# EAGLE design 7006268-1 (EAGLE 6.6.0)
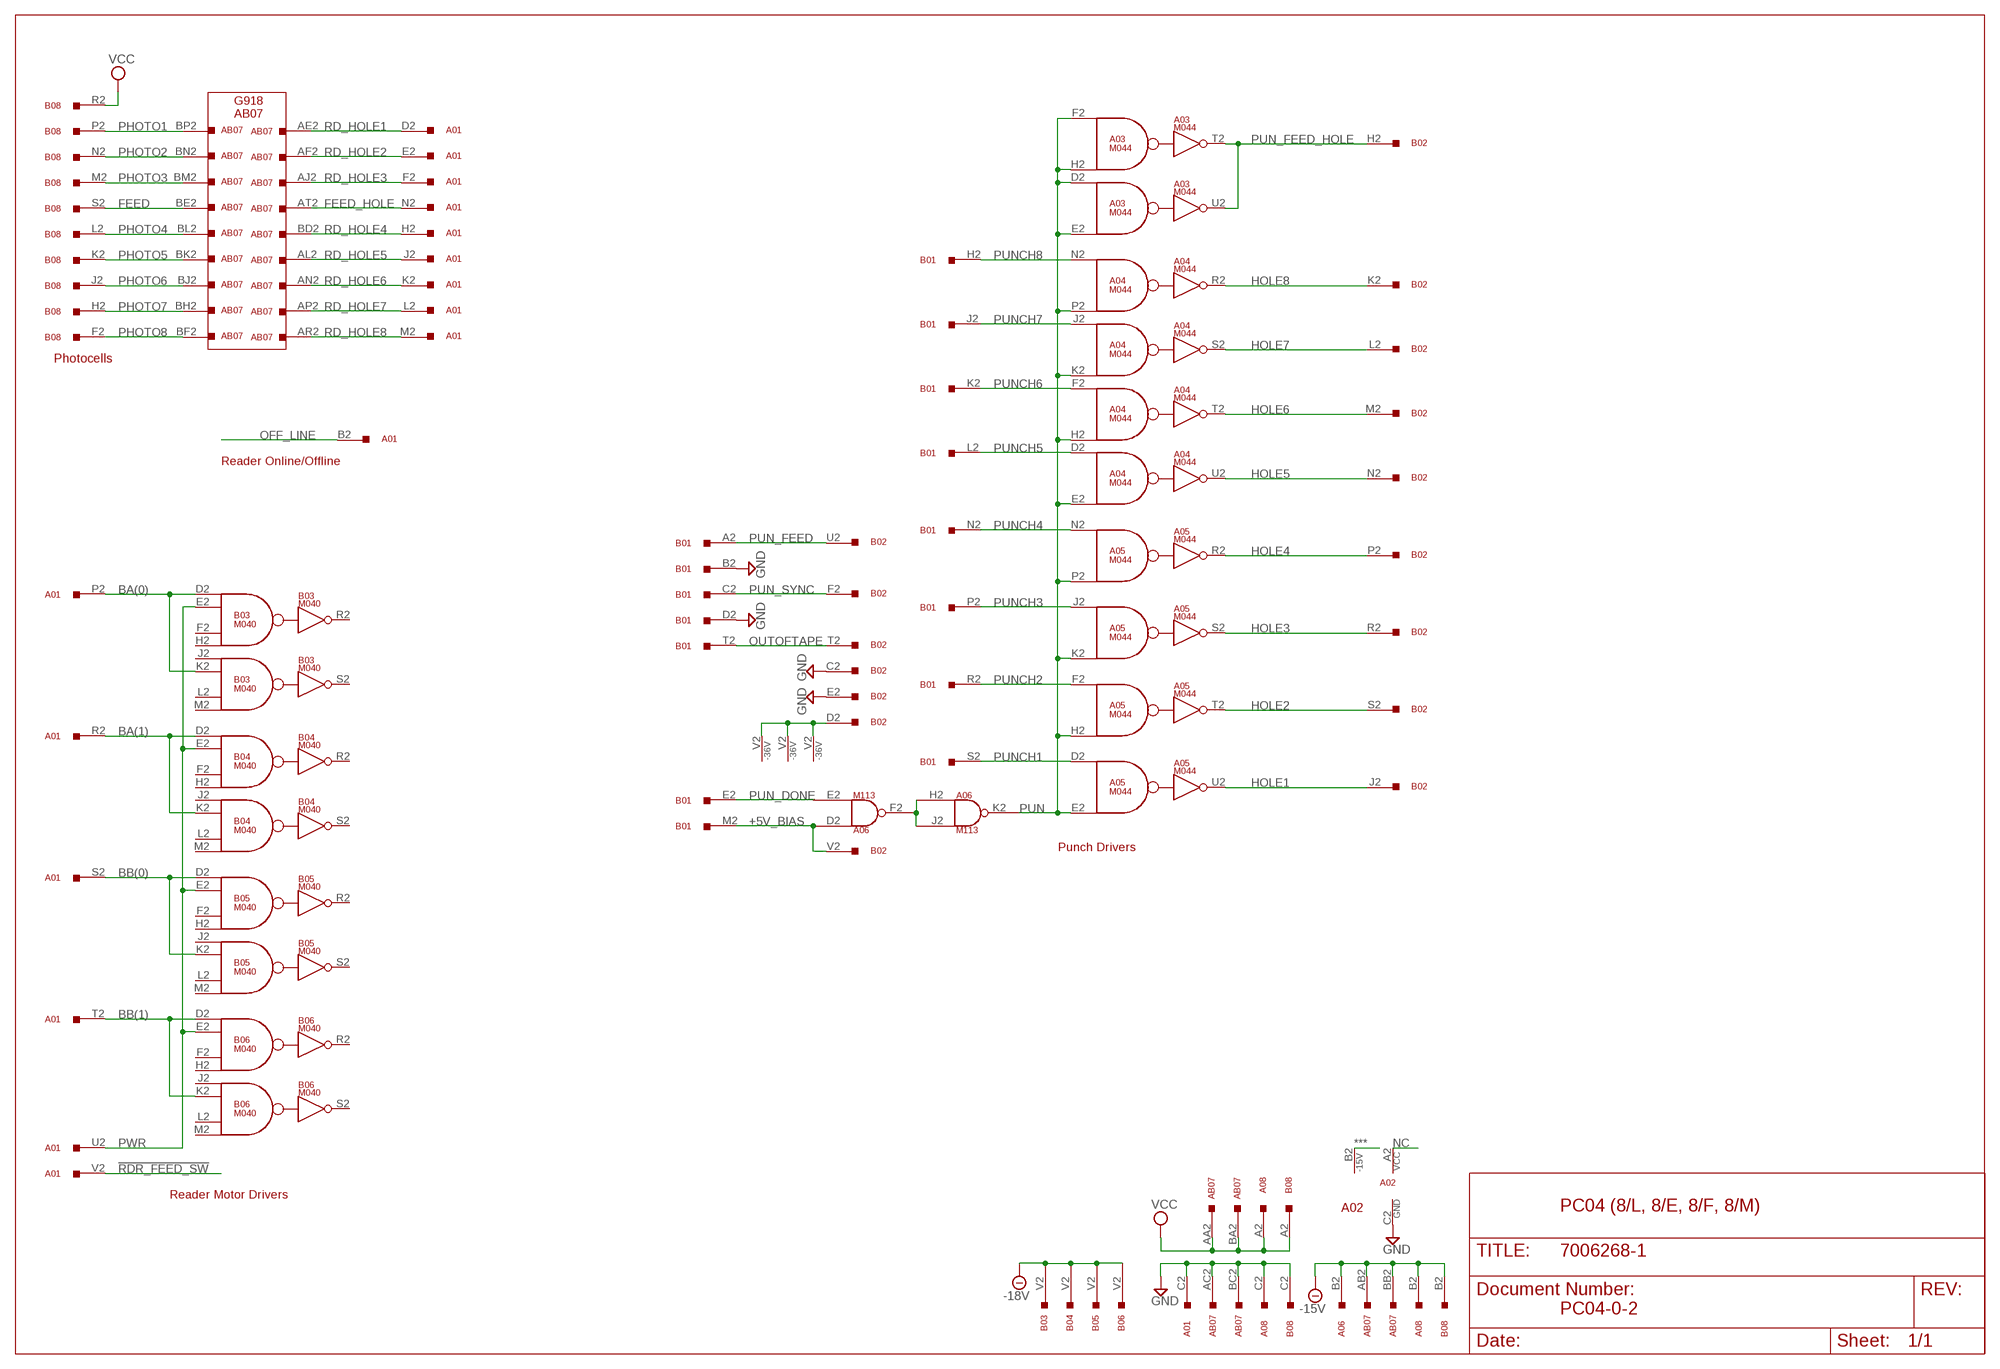
[diagram p0: schematic, sheet 1]

## Parts
A01  W033  W023  [H807]
A02  EMPTY  [H807]
A03  M044  [H807]
A04  M044  [H807]
A05  M044  [H807]
A06  M113  [H807]
A08  W033  W023  [H807]
AB07  G918  W991  [H807-2]
B01  W033  W023  [H807]
B02  W033  W023  [H807]
B03  M040  [H807]
B04  M040  [H807]
B05  M040  [H807]
B06  M040  [H807]
B08  W033  W023  [H807]

## Nets
!RDR_FEED_SW: A01.V2
***: A02.B2
+5V_BIAS: A06.D2(F2:IN1) B01.M2 B02.V2
-15V: A06.B2 A08.B2 AB07.AB2 AB07.BB2 B08.B2
-18V: B03.V2 B04.V2 B05.V2 B06.V2
-36V: A03.V2(-36V) A04.V2(-36V) A05.V2(-36V) B02.D2
BA(0): A01.P2 B03.D2(D) B03.K2(E)
BA(1): A01.R2 B04.D2(D) B04.K2(E)
BB(0): A01.S2 B05.D2(D) B05.K2(E)
BB(1): A01.T2 B06.D2(D) B06.K2(E)
FEED: AB07.BE2 B08.S2
FEED_HOLE: A01.N2 AB07.AT2
GND: A01.C2 A02.C2 A08.C2 AB07.AC2 AB07.BC2 B01.B2 B01.D2 B02.C2 B02.E2 B08.C2
HOLE1: A05.U2(R) B02.J2
HOLE2: A05.T2(R) B02.S2
HOLE3: A05.S2(R) B02.R2
HOLE4: A05.R2(R) B02.P2
HOLE5: A04.U2(R) B02.N2
HOLE6: A04.T2(R) B02.M2
HOLE7: A04.S2(R) B02.L2
HOLE8: A04.R2(R) B02.K2
N$4: A06.F2(F2:OUT) A06.H2(K2:IN1) A06.J2(K2:IN2)
NC: A02.A2
OFF_LINE: A01.B2
OUTOFTAPE: B01.T2 B02.T2
PHOTO1: AB07.BP2 B08.P2
PHOTO2: AB07.BN2 B08.N2
PHOTO3: AB07.BM2 B08.M2
PHOTO4: AB07.BL2 B08.L2
PHOTO5: AB07.BK2 B08.K2
PHOTO6: AB07.BJ2 B08.J2
PHOTO7: AB07.BH2 B08.H2
PHOTO8: AB07.BF2 B08.F2
PUN: A03.D2(D) A03.E2(H) A03.F2(D) A03.H2(H) A04.E2(H) A04.H2(H) A04.K2(H) A04.P2(H) A05.E2(H) A05.H2(H) A05.K2(H) A05.P2(H) A06.K2(K2:OUT)
PUN_DONE: A06.E2(F2:IN2) B01.E2
PUN_FEED: B01.A2 B02.U2
PUN_FEED_HOLE: A03.T2(R) A03.U2(R) B02.H2
PUN_SYNC: B01.C2 B02.F2
PUNCH1: A05.D2(D) B01.S2
PUNCH2: A05.F2(D) B01.R2
PUNCH3: A05.J2(D) B01.P2
PUNCH4: A05.N2(D) B01.N2
PUNCH5: A04.D2(D) B01.L2
PUNCH6: A04.F2(D) B01.K2
PUNCH7: A04.J2(D) B01.J2
PUNCH8: A04.N2(D) B01.H2
PWR: A01.U2 B03.E2(E) B04.E2(E) B05.E2(E) B06.E2(E)
RD_HOLE1: A01.D2 AB07.AE2
RD_HOLE2: A01.E2 AB07.AF2
RD_HOLE3: A01.F2 AB07.AJ2
RD_HOLE4: A01.H2 AB07.BD2
RD_HOLE5: A01.J2 AB07.AL2
RD_HOLE6: A01.K2 AB07.AN2
RD_HOLE7: A01.L2 AB07.AP2
RD_HOLE8: A01.M2 AB07.AR2
VCC: A08.A2 AB07.AA2 AB07.BA2 B08.A2 B08.R2
Unconnected: A01.A2 A03.J2(D) A03.K2(H) A03.N2(D) A03.P2(H) A03.R2(R) A03.S2(R) A06.A1(C1:IN1) A06.B1(C1:IN2) A06.C1(C1:OUT) A06.D1(F1:IN1) A06.E1(F1:IN2) A06.F1(F1:OUT) A06.H1(K1:IN1) A06.J1(K1:IN2) A06.K1(K1:OUT) A06.L1(N1:IN1) A06.L2(N2:IN1) A06.M1(N1:IN2) A06.M2(N2:IN2) A06.N1(N1:OUT) A06.N2(N2:OUT) A06.P1(S1:IN1) A06.P2(S2:IN1) A06.R1(S1:IN2) A06.R2(S2:IN2) A06.S1(S1:OUT) A06.S2(S2:OUT) A06.T2(V2:IN1) A06.U1 A06.U2(V2:IN2) A06.V1 A06.V2(V2:OUT) A08.D2 A08.E2 A08.F2 A08.H2 A08.J2 A08.K2 A08.L2 A08.M2 A08.N2 A08.P2 A08.R2 A08.S2 A08.T2 A08.U2 A08.V2 AB07.AD2 AB07.AH2 AB07.AK2 AB07.AM2 AB07.AS2 AB07.AU2 AB07.AV2 AB07.BR2 AB07.BS2 AB07.BT2 AB07.BU2 AB07.BV2 B01.F2 B01.U2 B01.V2 B02.A2 B02.B2 B03.F2(F) B03.H2(H) B03.J2(D) B03.L2(F) B03.M2(H) B03.R2(R) B03.S2(R) B04.F2(F) B04.H2(H) B04.J2(D) B04.L2(F) B04.M2(H) B04.R2(R) B04.S2(R) B05.F2(F) B05.H2(H) B05.J2(D) B05.L2(F) B05.M2(H) B05.R2(R) B05.S2(R) B06.F2(F) B06.H2(H) B06.J2(D) B06.L2(F) B06.M2(H) B06.R2(R) B06.S2(R) B08.D2 B08.E2 B08.T2 B08.U2 B08.V2

## Notes on the sheet
- G918
- AB07
- Photocells
- Reader Online/Offline
- Punch Drivers
- Reader Motor Drivers
- PC04 (8/L, 8/E, 8/F, 8/M)
- PC04-0-2

## Power pins joined to a net without a drawn wire
-15V: A03.B2(-15V) A04.B2(-15V) A05.B2(-15V) B03.B2(-15V) B04.B2(-15V) B05.B2(-15V) B06.B2(-15V)
GND: A03.C2(GND) A03.M2(GND) A04.C2(GND) A04.M2(GND) A05.C2(GND) A05.M2(GND) A06.C2(GND) A06.T1(GND) B03.C2(GND) B04.C2(GND) B05.C2(GND) B06.C2(GND)
VCC: A03.A2(VCC) A04.A2(VCC) A05.A2(VCC) A06.A2(VCC) B03.A2(VCC) B04.A2(VCC) B05.A2(VCC) B06.A2(VCC)

## Library data of the parts
A01 A08 B01 B02 B08 = dec-m:W023: One-sided 18 pin connector/cable.
A02 = dec-m:EMPTY: Empty Slot
A03-A05 = dec-m:M044: Quad Two Input Solenoid Driver
A06 = dec-m:M113: 10 2-input NAND Gates
AB07 = dec-m:W991: One-sided 36 pin (double hight) connector/cable.
B03-B06 = dec-m:M040: M040 Solenoid Driver

## Net classes
0 default: width 0.813 mm

## Board
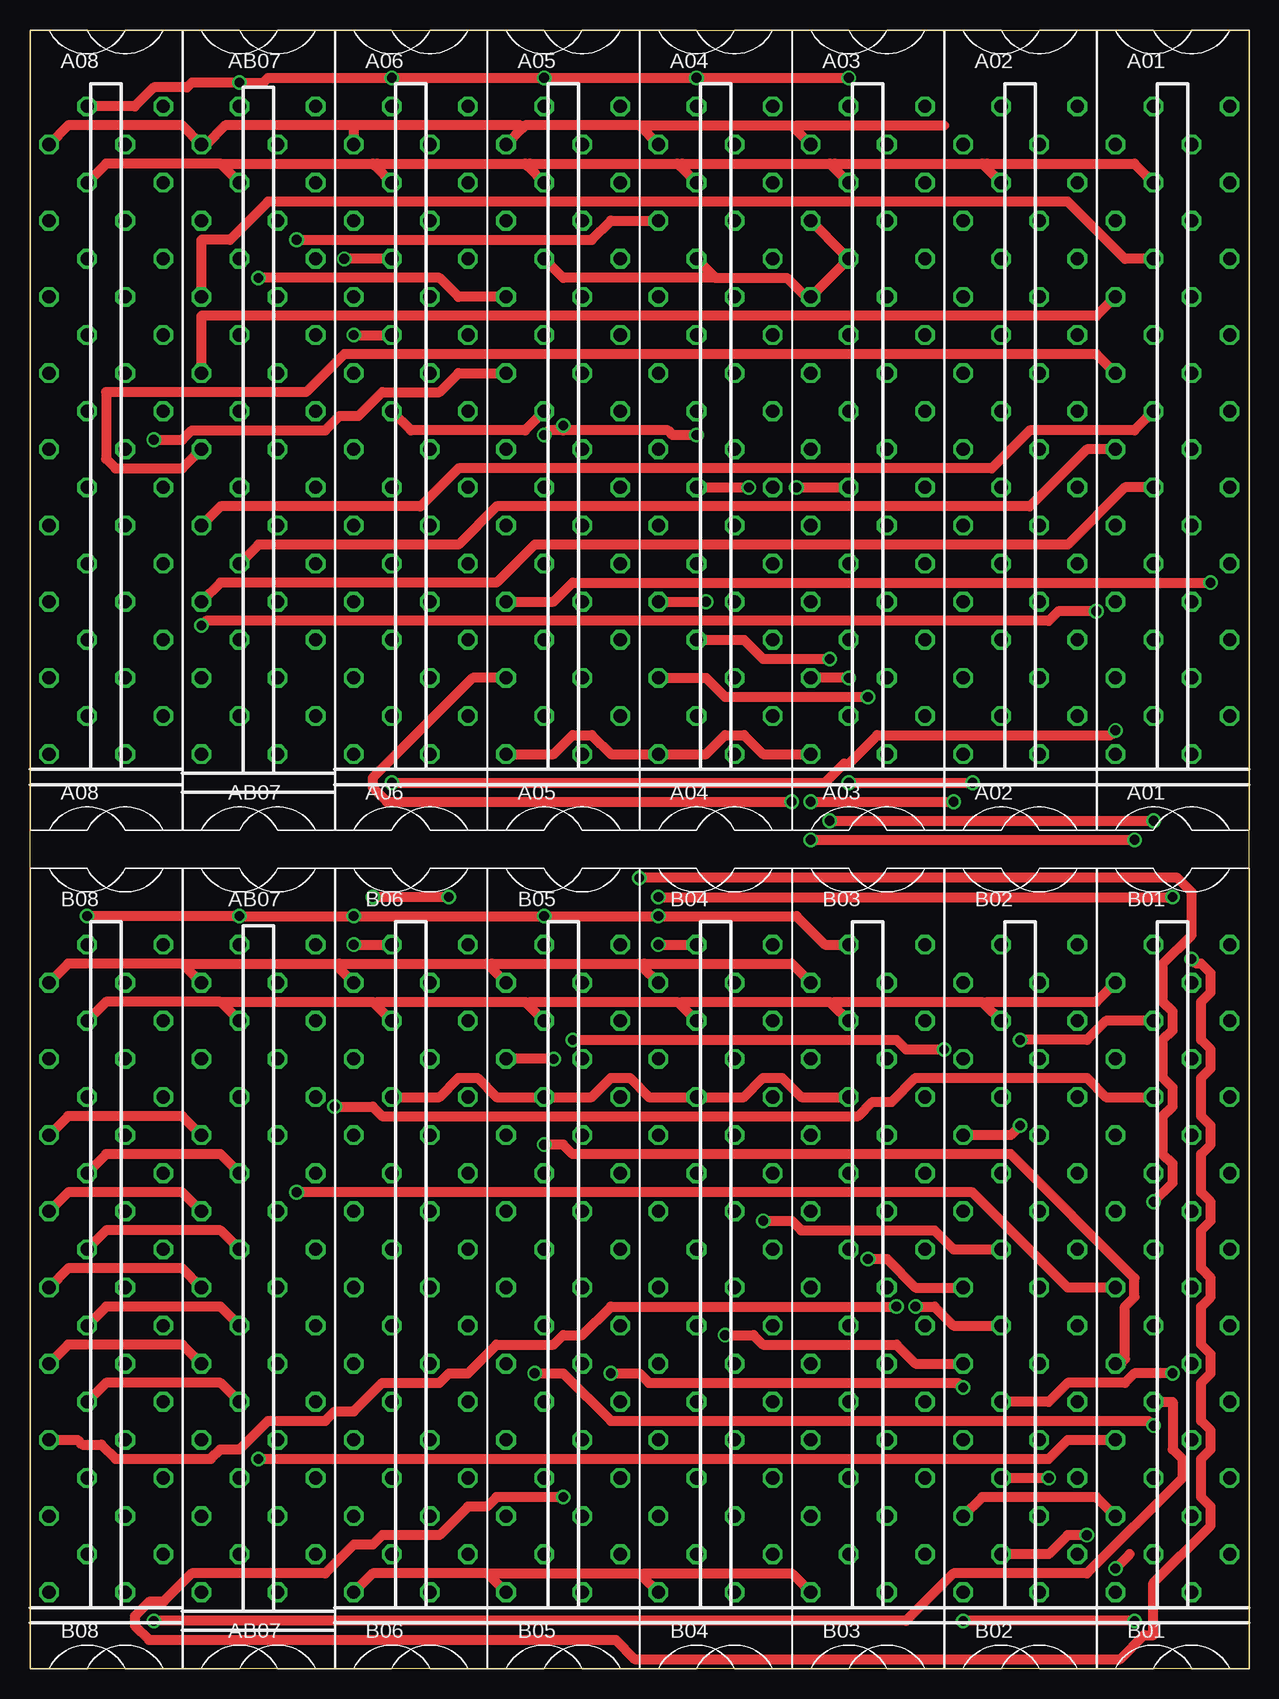
[diagram p1: board, top side]
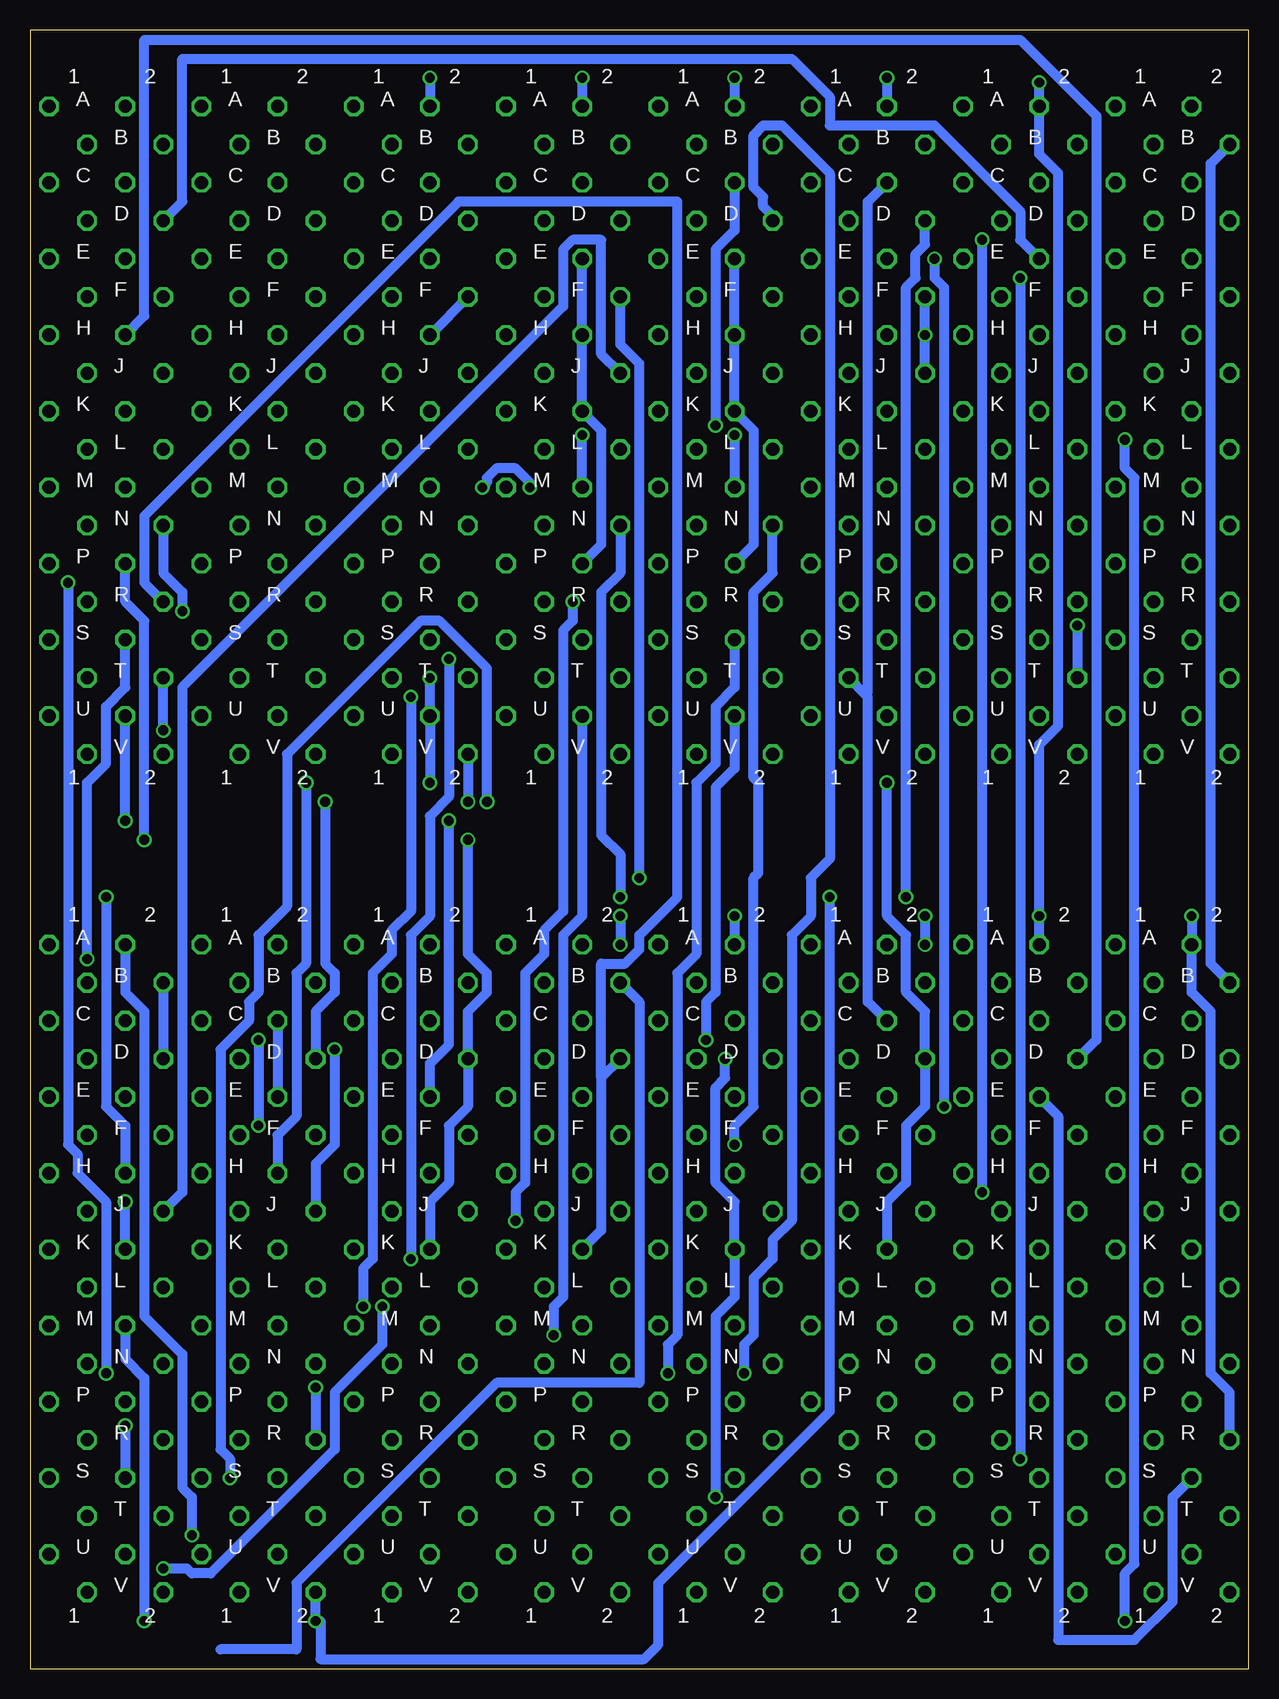
[diagram p2: board, bottom side, seen from below]

Size 101.6 x 136.53 mm. Coordinates in mm from the lower left corner, seen from the top.
Outline: 0,136.53 101.6,136.53 101.6,0 0,0 0,136.53
Copper layers (1+16): Top 0.035mm / dielectric 1.5mm / Bottom 0.035mm
Design rules "16mils": minimum track width 16mil, minimum drill 32mil, track to track 15mil, track to pad 10mil, pad to pad 10mil, via to via 10mil, smd to smd 10mil, copper to edge 13mil, drill to drill 10mil, minimum pad ring 10mil, minimum via ring 8mil, stop-mask expansion 0mil, vias tented up to drill 0mil, thermal gap 10mil

### Footprints (pad centres in the part's own frame; a part is rotated, then mirrored left to right if it is on the bottom)
H807 = drill 1.092 octagon: A1 4.763,28.575; A2 -1.587,28.575; B1 1.587,25.4; B2 -4.763,25.4; C1 4.763,22.225; C2 -1.587,22.225; D1 1.587,19.05; D2 -4.763,19.05; E1 4.763,15.875; E2 -1.587,15.875; F1 1.587,12.7; F2 -4.763,12.7; H1 4.763,9.525; H2 -1.587,9.525; J1 1.587,6.35; J2 -4.763,6.35; K1 4.763,3.175; K2 -1.587,3.175; L1 1.587,0; L2 -4.763,0; M1 4.763,-3.175; M2 -1.587,-3.175; N1 1.587,-6.35; N2 -4.763,-6.35; P1 4.763,-9.525; P2 -1.587,-9.525; R1 1.587,-12.7; R2 -4.763,-12.7; S1 4.763,-15.875; S2 -1.587,-15.875; T1 1.587,-19.05; T2 -4.763,-19.05; U1 4.763,-22.225; U2 -1.587,-22.225; V1 1.587,-25.4; V2 -4.763,-25.4
H807-2 = drill 1.092 octagon: AA1 4.763,60.325; AA2 -1.587,60.325; AB1 1.587,57.15; AB2 -4.763,57.15; AC1 4.763,53.975; AC2 -1.587,53.975; AD1 1.587,50.8; AD2 -4.763,50.8; AE1 4.763,47.625; AE2 -1.587,47.625; AF1 1.587,44.45; AF2 -4.763,44.45; AH1 4.763,41.275; AH2 -1.587,41.275; AJ1 1.587,38.1; AJ2 -4.763,38.1; AK1 4.763,34.925; AK2 -1.587,34.925; AL1 1.587,31.75; AL2 -4.763,31.75; AM1 4.763,28.575; AM2 -1.587,28.575; AN1 1.587,25.4; AN2 -4.763,25.4; AP1 4.763,22.225; AP2 -1.587,22.225; AR1 1.587,19.05; AR2 -4.763,19.05; AS1 4.763,15.875; AS2 -1.587,15.875; AT1 1.587,12.7; AT2 -4.763,12.7; AU1 4.763,9.525; AU2 -1.587,9.525; AV1 1.587,6.35; AV2 -4.763,6.35; BA1 4.763,-9.525; BA2 -1.587,-9.525; BB1 1.587,-12.7; BB2 -4.763,-12.7; BC1 4.763,-15.875; BC2 -1.587,-15.875; BD1 1.587,-19.05; BD2 -4.763,-19.05; BE1 4.763,-22.225; BE2 -1.587,-22.225; BF1 1.587,-25.4; BF2 -4.763,-25.4; BH1 4.763,-28.575; BH2 -1.587,-28.575; BJ1 1.587,-31.75; BJ2 -4.763,-31.75; BK1 4.763,-34.925; BK2 -1.587,-34.925; BL1 1.587,-38.1; BL2 -4.763,-38.1; BM1 4.763,-41.275; BM2 -1.587,-41.275; BN1 1.587,-44.45; BN2 -4.763,-44.45; BP1 4.763,-47.625; BP2 -1.587,-47.625; BR1 1.587,-50.8; BR2 -4.763,-50.8; BS1 4.763,-53.975; BS2 -1.587,-53.975; BT1 1.587,-57.15; BT2 -4.763,-57.15; BU1 4.763,-60.325; BU2 -1.587,-60.325; BV1 1.587,-63.5; BV2 -4.763,-63.5

### Placement (x,y rotation side)
A01  95.25,101.6 0 top
A02  82.55,101.6 0 top
A03  69.85,101.6 0 top
A04  57.15,101.6 0 top
A05  44.45,101.6 0 top
A06  31.75,101.6 0 top
A08  6.35,101.6 0 top
AB07  19.05,69.85 0 top
B01  95.25,31.75 0 top
B02  82.55,31.75 0 top
B03  69.85,31.75 0 top
B04  57.15,31.75 0 top
B05  44.45,31.75 0 top
B06  31.75,31.75 0 top
B08  6.35,31.75 0 top

### Tracks (layer width: path | path; a pad name or v marks a point on that pad's centre or on a via)
+5V_BIAS  (via drill 0.81)
  Top 0.813: v92.08,3.97 v77.79,3.97 | v34.92,64.29 v28.57,64.29
  Bottom 0.813: B02.V2 v77.79,3.97 77.39,3.97 77.39,0.79 50.4,0.79 49.21,1.98 49.21,7.14 34.92,21.43 v34.92,64.29 | v92.08,3.97 92.08,24.21 93.66,25.8 B01.M2 | A06.D2 26.99,118.67 27.78,117.87 27.78,115.89 28.57,115.09 v28.57,64.29
-15V
  Top 0.813: A08.B2 3.17,128.59 12.7,128.59 AB07.AB2 14.68,127 16.27,128.59 26.99,128.59 | 41.08,128.39 41.27,128.59 50.8,128.59 | 41.08,128.39 A05.B2 | A04.B2 50.8,128.59 | 63.7,128.39 63.5,128.59 50.8,128.59 | 63.7,128.39 A03.B2 | 76.2,128.59 63.9,128.59 63.7,128.39 | 26.99,128.59 40.88,128.59 41.08,128.39 | B08.B2 3.17,58.74 12.7,58.74 | AB07.BB2 12.7,58.74 | 25.6,58.54 25.4,58.74 12.7,58.74 | 25.6,58.54 B06.B2 | 38.3,58.54 38.1,58.74 25.8,58.74 25.6,58.54 | 38.3,58.54 B05.B2 | 51,58.54 50.8,58.74 38.5,58.74 38.3,58.54 | 51,58.54 B04.B2 | B03.B2 63.5,58.74 51.2,58.74 51,58.54 | 26.99,128.59 A06.B2
  Bottom 0.813: 85.72,1.59 79.38,1.59 79.38,7.14 62.71,23.81 50.8,23.81 50.8,55.56 B04.B2 | A08.B2 3.17,125.41 3.17,58.74 B08.B2
-18V
  Top 0.813: B06.V2 28.57,7.94 38.1,7.94 | B05.V2 38.1,7.94 | 51,7.74 50.8,7.94 38.1,7.94 | 51,7.74 B04.V2 | B03.V2 63.5,7.94 51.2,7.94 51,7.74
-36V  (via drill 0.81)
  Top 0.813: A05.V2 43.66,76.2 45.24,77.79 46.83,77.79 48.42,76.2 A04.V2 56.36,76.2 57.94,77.79 59.53,77.79 61.12,76.2 A03.V2 | v65.09,72.23 v76.99,72.23
  Bottom 0.813: B02.D2 77.79,54.77 76.2,56.36 76.2,57.94 76.99,58.74 v76.99,72.23 | A03.V2 v65.09,72.23
BA(0)  (via drill 0.81)
  Top 0.813: v65.09,69.06 v92.08,69.06
  Bottom 0.813: B03.K2 68.26,38.89 66.67,40.48 66.67,45.24 65.09,46.83 B03.D2 65.09,54.77 63.5,56.36 63.5,57.94 65.09,59.53 v65.09,69.06 | A01.P2 93.66,88.9 92.08,87.31 v92.08,69.06
BA(1)
  Bottom 0.813: B04.K2 53.98,36.51 53.98,49.21 | B04.D2 53.98,49.21 | A01.R2 92.08,90.49 92.08,96.04 65.88,122.24 47.62,122.24 47.62,64.29 50.8,61.12 50.8,59.93 51.99,58.74 53.98,58.74 53.98,49.21
BB(0)  (via drill 0.81)
  Top 0.813: v43.66,50.8 B05.D2 | v96.84,59.13 97.23,58.74 97.63,58.74 98.42,57.94 98.42,56.36 97.63,55.56 97.63,52.39 98.42,51.59 98.42,50.01 97.63,49.21 97.63,46.04 98.42,45.24 98.42,43.66 97.63,42.86 97.63,39.69 98.42,38.89 98.42,37.31 97.63,36.51 97.63,33.34 98.42,32.54 98.42,30.96 97.63,30.16 97.63,26.99 98.42,26.19 98.42,24.61 97.63,23.81 97.63,20.64 98.42,19.84 98.42,18.26 97.63,17.46 97.63,14.29 98.42,13.49 98.42,11.91 93.66,7.14 93.66,2.78 92.87,2.78 90.88,0.79 50.4,0.79 48.82,2.38 9.92,2.38 8.73,3.57 8.73,4.37 9.92,5.56 11.11,5.56 13.49,7.94 24.61,7.94 26.99,10.32 28.57,10.32 29.37,11.11 34.13,11.11 36.51,13.49 38.1,13.49 38.89,14.29 v44.45,14.29
  Bottom 0.813: v43.66,50.8 43.66,49.21 44.45,48.42 44.45,40.48 42.86,38.89 B05.K2 42.86,30.96 44.45,29.37 v44.45,14.29 | A01.S2 93.66,81.76 95.25,80.17 95.25,75.41 96.84,73.82 v96.84,59.13
BB(1)  (via drill 0.81)
  Top 0.813: v90.49,78.18 90.09,77.79 70.64,77.79 68.26,75.41 67.87,75.41 66.28,73.82 v30.16,73.82
  Bottom 0.813: B06.K2 30.16,38.89 28.57,40.48 28.57,45.24 26.99,46.83 B06.D2 26.99,54.77 28.57,56.36 28.57,61.12 30.16,62.71 v30.16,73.82 | v90.49,78.18 A01.T2
FEED
  Bottom 0.813: B08.S2 6.35,14.29 6.35,5.56 9.53,2.38 15.88,2.38 15.88,46.04 AB07.BE2
FEED_HOLE  (via drill 0.81)
  Top 0.813: v14.29,86.92 14.68,87.31 84.93,87.31 85.72,88.11 v88.9,88.11
  Bottom 0.813: v14.29,86.92 AB07.AT2 | v88.9,88.11 88.9,89.69 90.49,91.28 A01.N2
GND  (via drill 0.81)
  Top 0.813: A08.C2 6.35,125.41 15.88,125.41 | AB07.AC2 15.88,125.41 | 28.77,125.21 28.57,125.41 15.88,125.41 | 28.77,125.21 A06.C2 | 41.47,125.21 41.27,125.41 28.97,125.41 28.77,125.21 | 41.47,125.21 A05.C2 | 54.17,125.21 53.98,125.41 41.67,125.41 41.47,125.21 | 54.17,125.21 A04.C2 | 66.87,125.21 66.67,125.41 54.37,125.41 54.17,125.21 | 66.87,125.21 A03.C2 | 79.57,125.21 79.38,125.41 67.07,125.41 66.87,125.21 | 79.57,125.21 A02.C2 | A01.C2 92.08,125.41 79.77,125.41 79.57,125.21 | B08.C2 6.35,55.56 15.88,55.56 | AB07.BC2 15.88,55.56 | 28.77,55.36 28.57,55.56 15.88,55.56 | 28.77,55.36 B06.C2 | 41.47,55.36 41.27,55.56 28.97,55.56 28.77,55.36 | 41.47,55.36 B05.C2 | 54.17,55.36 53.98,55.56 41.67,55.56 41.47,55.36 | 54.17,55.36 B04.C2 | 66.87,55.36 66.67,55.56 54.37,55.56 54.17,55.36 | 66.87,55.36 B03.C2 | 79.57,55.36 79.38,55.56 67.07,55.56 66.87,55.36 | 79.57,55.36 B02.C2 | B01.B2 88.9,55.56 79.77,55.56 79.57,55.36 | v42.86,102.79 43.26,103.19 44.45,103.19 | 44.45,103.19 53.18,103.19 53.58,102.79 v55.56,102.79 | v63.9,98.42 A03.M2 | A04.M2 v59.93,98.42 | v44.45,103.58 44.45,103.19
  Bottom 0.813: B01.B2 B01.D2 | B02.C2 B02.E2 | 31.95,81.16 31.75,80.96 31.75,55.56 B06.C2 | 31.95,81.16 A06.T1 | A06.C2 31.75,122.24 31.75,81.36 31.95,81.16 | v42.86,102.79 A05.M2 | A04.M2 v55.56,102.79 | v63.9,98.42 63.5,98.82 63.5,99.22 62.71,100.01 61.12,100.01 59.93,98.82 v59.93,98.42 | v44.45,103.58 44.45,118.27 42.86,119.86 A05.C2
HOLE1  (via drill 0.81)
  Top 0.813: v76.2,51.59 73.03,51.59 72.23,52.39 v45.24,52.39
  Bottom 0.813: B02.J2 77.79,42.07 76.2,43.66 v76.2,51.59 | v45.24,52.39 45.24,55.56 44.45,56.36 44.45,73.42 42.86,75.01 A05.U2
HOLE2  (via drill 0.81)
  Top 0.813: v84.93,15.88 B02.S2 | v63.5,72.23 29.77,72.23 28.57,73.42 28.57,74.22 36.91,82.55 A05.T2
  Bottom 0.813: v84.93,15.88 84.93,17.46 85.72,18.26 85.72,51.59 83.34,53.98 83.34,55.56 82.55,56.36 82.55,61.12 80.17,63.5 80.17,76.2 69.06,87.31 67.47,87.31 63.5,83.34 v63.5,72.23
HOLE3  (via drill 0.81)
  Top 0.813: v77.79,23.42 77.39,23.81 51.59,23.81 50.8,24.61 v48.42,24.61
  Bottom 0.813: v77.79,23.42 B02.R2 | v48.42,24.61 48.42,26.99 47.62,27.78 47.62,57.94 46.04,59.53 46.04,73.82 44.45,75.41 44.45,80.17 42.86,81.76 A05.S2
HOLE4  (via drill 0.81)
  Top 0.813: B02.P2 84.93,22.23 86.52,23.81 91.28,23.81 92.08,24.61 v95.25,24.61 | v98.42,90.49 45.24,90.49 43.66,88.9 A05.R2
  Bottom 0.813: v95.25,24.61 95.25,38.89 97.63,41.27 97.63,42.86 98.42,43.66 v98.42,90.49
HOLE5  (via drill 0.81)
  Top 0.813: B02.N2 73.82,25.4 72.23,26.99 61.12,26.99 60.33,27.78 v57.94,27.78
  Bottom 0.813: v57.94,27.78 57.94,30.16 57.15,30.96 57.15,61.12 55.56,62.71 A04.U2
HOLE6  (via drill 0.81)
  Top 0.813: B02.M2 76.99,28.57 75.41,30.16 v73.82,30.16 | v69.85,80.96 57.94,80.96 56.36,82.55 A04.T2
  Bottom 0.813: v73.82,30.16 73.82,33.34 73.03,34.13 73.03,57.94 71.44,59.53 71.44,61.52 69.85,63.1 v69.85,80.96
HOLE7  (via drill 0.81)
  Top 0.813: B02.L2 73.82,31.75 71.44,34.13 v69.85,34.13 | v66.67,84.14 61.12,84.14 59.53,85.72 A04.S2
  Bottom 0.813: v69.85,34.13 69.85,61.12 68.26,62.71 68.26,71.04 66.67,72.63 v66.67,84.14
HOLE8  (via drill 0.81)
  Top 0.813: B02.K2 76.99,34.92 75.41,36.51 64.29,36.51 63.5,37.31 v61.12,37.31 | A04.R2 v56.36,88.9
  Bottom 0.813: v61.12,37.31 61.12,39.69 60.33,40.48 60.33,57.94 58.74,59.53 58.74,61.52 57.15,63.1 57.15,86.52 56.36,87.31 v56.36,88.9
N$4  (via drill 0.81)
  Top 0.813: v26.99,111.12 A06.H2
  Bottom 0.813: A06.J2 v26.99,111.12 A06.F2
OUTOFTAPE
  Top 0.813: B02.T2 79.38,14.29 88.9,14.29 B01.T2
PHOTO1
  Top 0.813: B08.P2 6.35,23.81 15.88,23.81 AB07.BP2
PHOTO2
  Top 0.813: B08.N2 3.17,26.99 12.7,26.99 AB07.BN2
PHOTO3
  Top 0.813: B08.M2 6.35,30.16 15.88,30.16 AB07.BM2
PHOTO4
  Top 0.813: B08.L2 3.17,33.34 12.7,33.34 AB07.BL2
PHOTO5
  Top 0.813: B08.K2 6.35,36.51 15.88,36.51 AB07.BK2
PHOTO6
  Top 0.813: B08.J2 3.17,39.69 12.7,39.69 AB07.BJ2
PHOTO7
  Top 0.813: B08.H2 6.35,42.86 15.88,42.86 AB07.BH2
PHOTO8
  Top 0.813: B08.F2 3.17,46.04 12.7,46.04 AB07.BF2
PUN
  Top 0.813: A06.K2 31.75,103.19 41.27,103.19 A05.K2 | A03.D2 67.87,117.87 68.26,117.87 A03.E2 A03.F2 64.69,114.3 63.1,115.89 57.15,115.89 | A04.E2 57.15,115.89 | A05.E2 44.45,115.89 57.15,115.89
  Bottom 0.813: A05.P2 41.27,93.66 41.27,103.19 A05.K2 A05.H2 A05.E2 | A03.F2 A03.H2 | A04.P2 53.98,93.66 53.98,103.19 A04.K2 A04.H2 A04.E2
PUN_DONE  (via drill 0.81)
  Top 0.813: B01.E2 89.69,47.62 88.11,49.21 73.82,49.21 71.83,47.23 70.25,47.23 69.06,46.04 29.37,46.04 28.57,46.83 v25.4,46.83 | A06.E2 v26.19,117.47
  Bottom 0.813: v25.4,46.83 25.4,115.09 26.19,115.89 v26.19,117.47
PUN_FEED  (via drill 0.81)
  Top 0.813: B02.U2 84.93,9.53 86.52,11.11 v88.11,11.11
  Bottom 0.813: v88.11,11.11 88.11,14.29 88.9,15.08 88.9,26.19 92.08,29.37 92.08,54.77 93.66,56.36 B01.A2
PUN_FEED_HOLE  (via drill 0.81)
  Top 0.813: v68.26,73.82 v78.58,73.82 | v68.26,82.55 A03.T2
  Bottom 0.813: B02.H2 80.96,44.45 79.38,46.04 79.38,57.94 78.58,58.74 v78.58,73.82 | v68.26,73.82 A03.U2 v68.26,82.55
PUN_SYNC  (via drill 0.81)
  Top 0.813: B02.F2 81.76,44.45 v82.55,45.24 | v82.55,52.39 88.11,52.39 89.69,53.98 B01.C2
  Bottom 0.813: v82.55,52.39 v82.55,45.24
PUNCH1  (via drill 0.81)
  Top 0.813: v93.66,20.24 93.27,20.64 48.42,20.64 44.45,24.61 v42.07,24.61
  Bottom 0.813: v93.66,20.24 B01.S2 | v42.07,24.61 42.07,26.99 41.27,27.78 41.27,32.54 39.69,34.13 39.69,35.72 38.1,37.31 38.1,61.12 36.51,62.71 36.51,65.88 34.92,67.47 34.92,124.62 38.89,128.59 40.48,128.59 41.27,127.79 41.27,123.43 40.48,122.63 40.48,121.84 39.69,121.05 A05.D2
PUNCH2  (via drill 0.81)
  Top 0.813: B01.R2 86.52,19.05 84.93,17.46 v19.05,17.46 | v19.05,115.89 34.13,115.89 35.72,114.3 A05.F2
  Bottom 0.813: v19.05,115.89 v19.05,17.46
PUNCH3  (via drill 0.81)
  Top 0.813: A05.J2 35.72,107.95 34.13,106.36 29.37,106.36 27.38,104.38 25.8,104.38 24.61,103.19 13.49,103.19 12.7,102.39 v10.32,102.39 | v10.32,3.97 73.03,3.97 76.99,7.94 88.11,7.94 96.04,15.88 96.04,17.46 95.25,18.26 95.25,22.23 B01.P2
  Bottom 0.813: v10.32,102.39 10.32,100.01 9.53,99.22 9.53,8.73 10.32,7.94 v10.32,3.97
PUNCH4  (via drill 0.81)
  Top 0.813: v42.86,43.66 44.45,43.66 45.24,42.86 81.76,42.86 92.08,32.54 92.08,30.96 91.28,30.16 91.28,25.8 90.88,25.4 B01.N2
  Bottom 0.813: A05.N2 39.69,91.28 41.27,89.69 41.27,74.22 40.88,73.82 40.88,66.28 41.27,65.88 41.27,46.83 42.86,45.24 v42.86,43.66
PUNCH5  (via drill 0.81)
  Top 0.813: A04.D2 48.42,120.65 46.83,119.06 v22.23,119.06 | v22.23,39.69 78.58,39.69 86.52,31.75 B01.L2
  Bottom 0.813: v22.23,39.69 v22.23,119.06
PUNCH6  (via drill 0.81)
  Top 0.813: v50.8,65.88 95.65,65.88 96.84,64.69 96.84,61.12 94.46,58.74 94.46,55.56 95.25,54.77 95.25,53.18 94.46,52.39 94.46,49.21 95.25,48.42 95.25,46.83 94.46,46.04 94.46,42.86 95.25,42.07 95.25,40.48 v93.66,38.89
  Bottom 0.813: A04.F2 52.39,110.33 50.8,108.74 v50.8,65.88 | B01.K2 v93.66,38.89
PUNCH7
  Bottom 0.813: B01.J2 88.9,39.69 88.9,81.76 57.15,113.51 57.15,118.27 56.36,119.06 53.98,119.06 53.98,109.54 A04.J2
PUNCH8  (via drill 0.81)
  Top 0.813: v52.39,64.29 v95.25,64.29
  Bottom 0.813: B01.H2 93.66,45.24 95.25,46.83 v95.25,64.29 | v52.39,64.29 52.39,67.87 53.98,69.45 53.98,89.69 52.39,91.28 A04.N2
PWR  (via drill 0.81)
  Top 0.813: B06.E2 34.13,47.62 35.72,49.21 37.31,49.21 38.89,47.62 B05.E2 46.83,47.62 48.42,49.21 50.01,49.21 51.59,47.62 B04.E2 59.53,47.62 61.12,49.21 62.71,49.21 64.29,47.62 B03.E2 | v66.67,70.64 v93.66,70.64
  Bottom 0.813: v93.66,70.64 A01.U2 | v66.67,70.64 66.67,51.99 68.26,50.4 B03.E2
RD_HOLE1
  Bottom 0.813: AB07.AE2 19.05,119.06 19.05,121.44 26.19,128.59 34.92,128.59 34.92,130.97 38.1,134.14 88.9,134.14 88.9,122.24 A01.D2
RD_HOLE2
  Top 0.813: AB07.AF2 14.29,119.06 16.67,119.06 19.84,122.24 86.52,122.24 91.28,117.47 A01.E2
RD_HOLE3
  Top 0.813: AB07.AJ2 14.29,112.71 88.9,112.71 A01.F2
RD_HOLE4
  Bottom 0.813: AB07.BD2 12.7,52.39 12.7,129.38 19.05,135.73 92.08,135.73 92.08,112.71 A01.H2
RD_HOLE5
  Top 0.813: AB07.AL2 12.7,100.01 7.14,100.01 6.35,100.81 6.35,106.36 23.02,106.36 26.19,109.54 88.9,109.54 A01.J2
RD_HOLE6
  Top 0.813: AB07.AN2 15.88,96.84 32.54,96.84 35.72,100.01 80.17,100.01 83.34,103.19 92.08,103.19 A01.K2
RD_HOLE7
  Top 0.813: AB07.AP2 19.05,93.66 35.72,93.66 38.89,96.84 83.34,96.84 88.11,101.6 A01.L2
RD_HOLE8
  Top 0.813: AB07.AR2 15.88,90.49 38.89,90.49 42.07,93.66 86.52,93.66 91.28,98.42 A01.M2
VCC  (via drill 0.81)
  Top 0.813: A08.A2 8.73,130.18 10.32,131.76 13.1,131.76 13.49,132.16 v17.46,132.16 19.45,132.16 19.84,132.56 v30.16,132.56 v42.86,132.56 v55.56,132.56 v68.26,132.56 | v4.76,62.71 v17.46,62.71 v26.99,62.71 v42.86,62.71 v52.39,62.71 63.9,62.71 66.28,60.33 B03.A2 | v26.99,60.33 B06.A2 | v52.39,60.33 B04.A2 | v90.49,8.33 91.68,9.53 | v72.23,30.16 48.42,30.16 46.04,27.78 44.45,27.78 43.66,26.99 38.89,26.99 36.51,24.61 34.92,24.61 34.13,23.81 29.37,23.81 26.99,21.43 25.4,21.43 24.61,20.64 19.84,20.64 17.46,18.26 15.88,18.26 15.08,17.46 7.14,17.46 5.95,18.65 4.37,18.65 3.97,19.05 B08.R2
  Bottom 0.813: v17.46,132.16 AB07.AA2 17.46,126.21 15.88,124.62 15.88,78.58 17.46,76.99 v17.46,62.71 AB07.BA2 | v30.16,132.56 A06.A2 | v42.86,132.56 A05.A2 | v55.56,132.56 A04.A2 | v68.26,132.56 A03.A2 | v4.76,62.71 B08.A2 4.76,56.36 3.17,54.77 3.17,24.61 1.59,23.02 B08.R2 | v26.99,62.71 v26.99,60.33 | v42.86,62.71 B05.A2 | v52.39,62.71 v52.39,60.33 | v90.49,8.33 88.5,8.33 88.11,7.94 86.52,7.94 76.2,18.26 76.2,23.02 72.23,26.99 v72.23,30.16